# EAGLE design SX-150 Mk II (EAGLE 7.4.0)
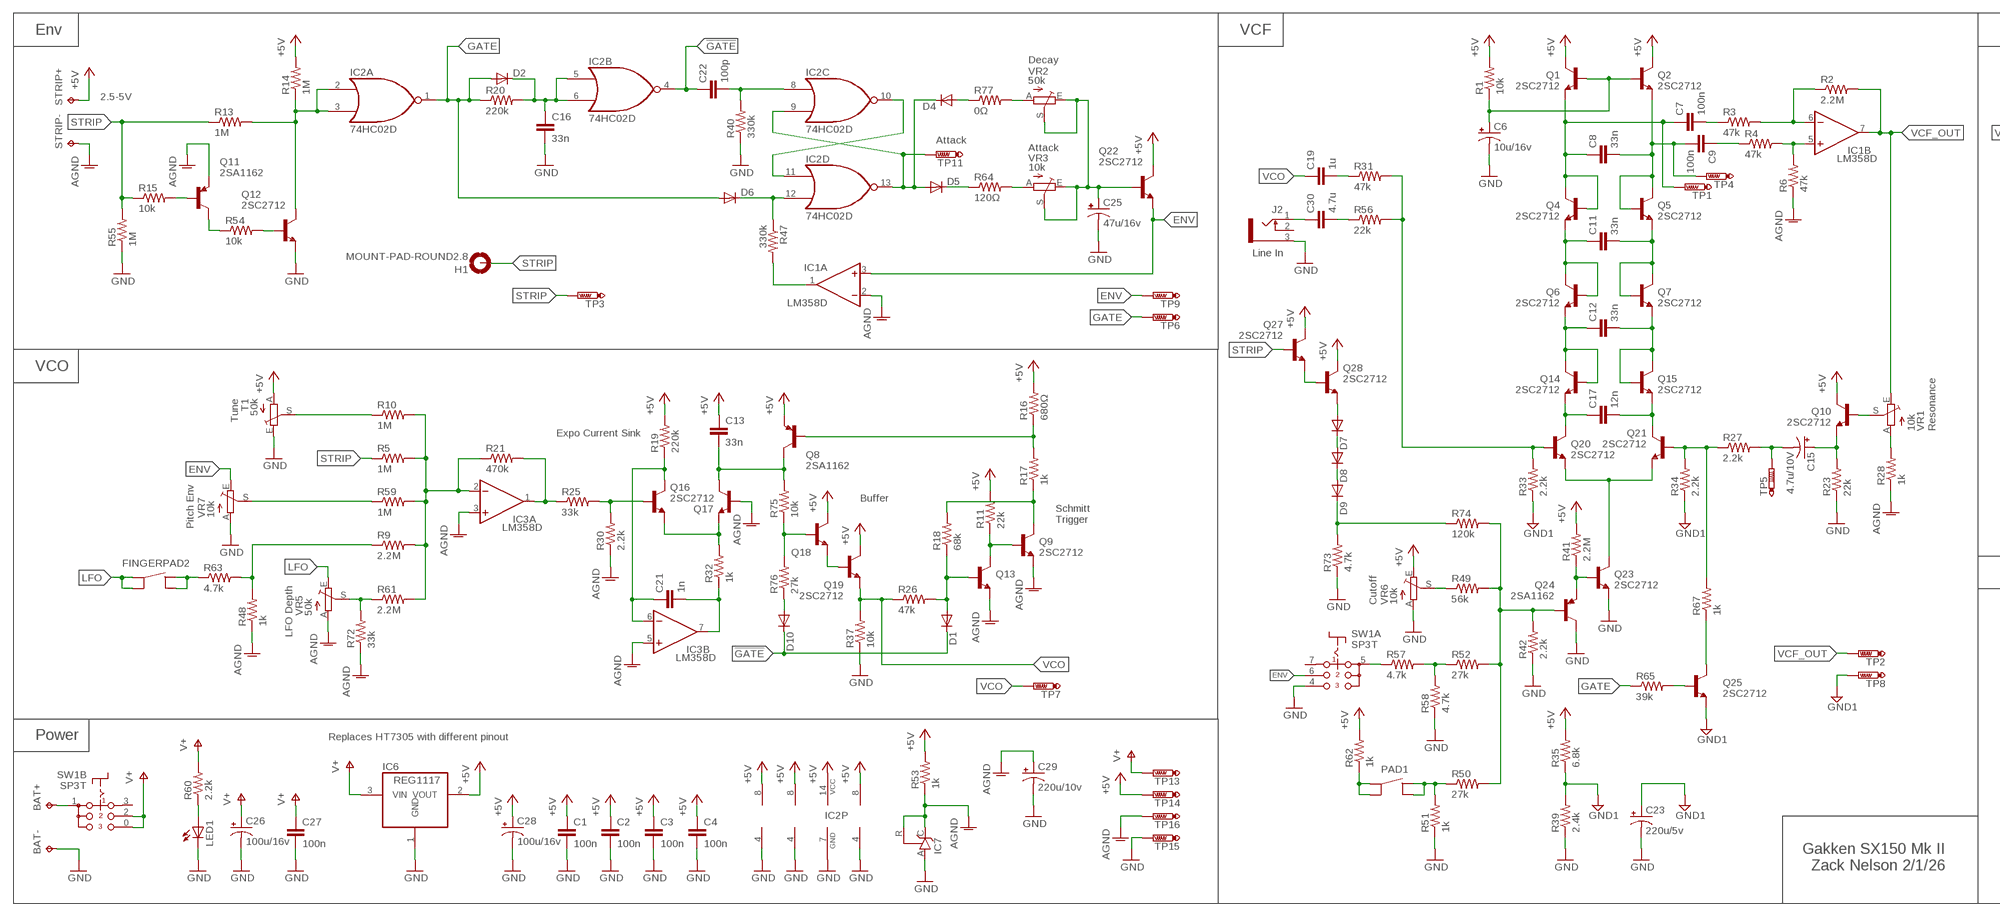
[diagram p0: schematic, sheet 1, part 1 of 2]
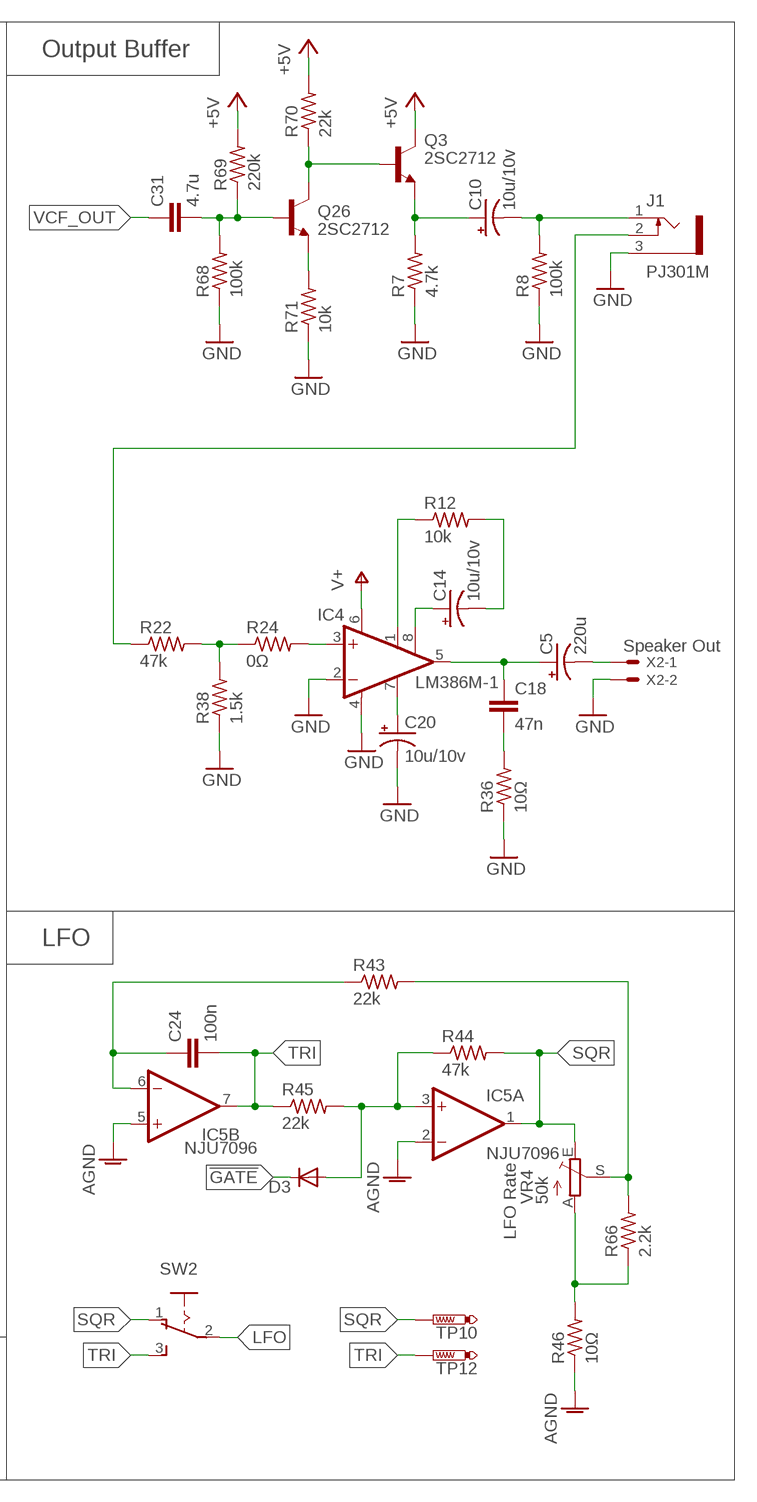
[diagram p1: schematic, sheet 1, part 2 of 2]

## Parts
BAT+  TPPAD1-13  [P1-13]
BAT-  TPPAD1-13  [P1-13]
C1  100n  C-EUC0603  [C0603]
C2  100n  C-EUC0603  [C0603]
C3  100n  C-EUC0603  [C0603]
C4  100n  C-EUC0603  [C0603]
C5  220u  CPOL-USE2.5-6  [E2,5-6]
C6  10u/16v  CPOL-USE2.5-6  [E2,5-6]
C7  100n  C-EUC0603  [C0603]
C8  33n  C-EUC0603  [C0603]
C9  100n  C-EUC0603  [C0603]
C10  10u/10v  CPOL-USE2.5-6  [E2,5-6]
C11  33n  C-EUC0603  [C0603]
C12  33n  C-EUC0603  [C0603]
C13  33n  C-EUC0603  [C0603]
C14  10u/10v  CPOL-USE2.5-6  [E2,5-6]
C15  4.7u/10V  CPOL-USE2.5-6  [E2,5-6]
C16  33n  C-EUC0603  [C0603]
C17  12n  C-EUC0603  [C0603]
C18  47n  C-EUC0603  [C0603]
C19  1u  C-EUC0603  [C0603]
C20  10u/10v  CPOL-USE2.5-6  [E2,5-6]
C21  1n  C-EUC0603  [C0603]
C22  100p  C-EUC0603  [C0603]
C23  220u/5v  CPOL-USE2.5-6  [E2,5-6]
C24  100n  C-EUC0603  [C0603]
C25  47u/16v  CPOL-USE2.5-6  [E2,5-6]
C26  100u/16v  CPOL-USE2.5-6  [E2,5-6]
C27  100n  C-EUC0603  [C0603]
C28  100u/16v  CPOL-USE2.5-6  [E2,5-6]
C29  220u/10v  CPOL-USE2.5-6  [E2,5-6]
C30  4.7u  C-EUC0603  [C0603]
C31  4.7u  C-EUC0603  [C0603]
D1  DIODE-DO41-7.6  [DO41-7.6]
D2  DIODE-MINIMELF  [MINIMELF]
D3  DIODE-MINIMELF  [MINIMELF]
D4  DIODE-MINIMELF  [MINIMELF]
D5  DIODE-MINIMELF  [MINIMELF]
D6  DIODE-MINIMELF  [MINIMELF]
D7  DIODE-MINIMELF  [MINIMELF]
D8  DIODE-MINIMELF  [MINIMELF]
D9  DIODE-MINIMELF  [MINIMELF]
D10  DIODE-DO41-7.6  [DO41-7.6]
FINGERPAD2  GAKKEN-PAD  [GAKKEN-PAD]
H1  MOUNT-PAD-ROUND2.8  [2,8-PAD]
IC1  LM358D  [SO08]
IC2  74HC02D  7402D  [SO14]
IC3  LM358D  [SO08]
IC4  LM386M-1  [SO08]
IC5  NJU7096  LM358D  [SO08]
IC6  REG1117  [SOT223]
IC7  TL431CLP  [TO92-CLP]
J1  PJ301M  WQP_PJ301M-12_JACK  [JACK-3.5-NOHOLE]
J2  Line In  WQP_PJ301M-12_JACK  [JACK-3.5-NOHOLE]
LED1  LED3MM  [LED3MM]
PAD1  GAKKEN-PAD  [GAKKEN-PAD]
Q1  2SC2712  BC808-NPN-SOT23-BEC  [SOT23-BEC]
Q2  2SC2712  BC808-NPN-SOT23-BEC  [SOT23-BEC]
Q3  2SC2712  BC808-NPN-SOT23-BEC  [SOT23-BEC]
Q4  2SC2712  BC808-NPN-SOT23-BEC  [SOT23-BEC]
Q5  2SC2712  BC808-NPN-SOT23-BEC  [SOT23-BEC]
Q6  2SC2712  BC808-NPN-SOT23-BEC  [SOT23-BEC]
Q7  2SC2712  BC808-NPN-SOT23-BEC  [SOT23-BEC]
Q8  2SA1162  BC807-16-PNP-SOT23-BEC  [SOT23-BEC]
Q9  2SC2712  BC808-NPN-SOT23-BEC  [SOT23-BEC]
Q10  2SC2712  BC808-NPN-SOT23-BEC  [SOT23-BEC]
Q11  2SA1162  BC807-16-PNP-SOT23-BEC  [SOT23-BEC]
Q12  2SC2712  BC808-NPN-SOT23-BEC  [SOT23-BEC]
Q13  2SC2712  BC808-NPN-SOT23-BEC  [SOT23-BEC]
Q14  2SC2712  BC808-NPN-SOT23-BEC  [SOT23-BEC]
Q15  2SC2712  BC808-NPN-SOT23-BEC  [SOT23-BEC]
Q16  2SC2712  BC808-NPN-SOT23-BEC  [SOT23-BEC]
Q17  2SC2712  BC808-NPN-SOT23-BEC  [SOT23-BEC]
Q18  2SC2712  BC808-NPN-SOT23-BEC  [SOT23-BEC]
Q19  2SC2712  BC808-NPN-SOT23-BEC  [SOT23-BEC]
Q20  2SC2712  BC808-NPN-SOT23-BEC  [SOT23-BEC]
Q21  2SC2712  BC808-NPN-SOT23-BEC  [SOT23-BEC]
Q22  2SC2712  BC808-NPN-SOT23-BEC  [SOT23-BEC]
Q23  2SC2712  BC808-NPN-SOT23-BEC  [SOT23-BEC]
Q24  2SA1162  BC807-16-PNP-SOT23-BEC  [SOT23-BEC]
Q25  2SC2712  BC808-NPN-SOT23-BEC  [SOT23-BEC]
Q26  2SC2712  BC808-NPN-SOT23-BEC  [SOT23-BEC]
Q27  2SC2712  BC808-NPN-SOT23-BEC  [SOT23-BEC]
Q28  2SC2712  BC808-NPN-SOT23-BEC  [SOT23-BEC]
R1  10k  R-US_R0603  [R0603]
R2  2.2M  R-US_R0603  [R0603]
R3  47k  R-US_R0603  [R0603]
R4  47k  R-US_R0603  [R0603]
R5  1M  R-US_R0603  [R0603]
R6  47k  R-US_R0603  [R0603]
R7  4.7k  R-US_R0603  [R0603]
R8  100k  R-US_R0603  [R0603]
R9  2.2M  R-US_R0603  [R0603]
R10  1M  R-US_R0603  [R0603]
R11  22k  R-US_R0603  [R0603]
R12  10k  R-US_R0603  [R0603]
R13  1M  R-US_R0603  [R0603]
R14  1M  R-US_R0603  [R0603]
R15  10k  R-US_R0603  [R0603]
R16  680Ω  R-US_R0603  [R0603]
R17  1k  R-US_R0603  [R0603]
R18  68k  R-US_R0603  [R0603]
R19  220k  R-US_R0603  [R0603]
R20  220k  R-US_R0603  [R0603]
R21  470k  R-US_R0603  [R0603]
R22  47k  R-US_R0603  [R0603]
R23  22k  R-US_R0603  [R0603]
R24  0Ω  R-US_R0603  [R0603]
R25  33k  R-US_R0603  [R0603]
R26  47k  R-US_R0603  [R0603]
R27  2.2k  R-US_R0603  [R0603]
R28  1k  R-US_R0603  [R0603]
R30  2.2k  R-US_R0603  [R0603]
R31  47k  R-US_R0603  [R0603]
R32  1k  R-US_R0603  [R0603]
R33  2.2k  R-US_R0603  [R0603]
R34  2.2k  R-US_R0603  [R0603]
R35  6.8k  R-US_R0603  [R0603]
R36  10Ω  R-US_R0603  [R0603]
R37  10k  R-US_R0603  [R0603]
R38  1.5k  R-US_R0603  [R0603]
R39  2.4k  R-US_R0603  [R0603]
R40  330k  R-US_R0603  [R0603]
R41  2.2M  R-US_R0603  [R0603]
R42  2.2k  R-US_R0603  [R0603]
R43  22k  R-US_R0603  [R0603]
R44  47k  R-US_R0603  [R0603]
R45  22k  R-US_R0603  [R0603]
R46  10Ω  R-US_R0603  [R0603]
R47  330k  R-US_R0603  [R0603]
R48  1k  R-US_R0603  [R0603]
R49  56k  R-US_R0603  [R0603]
R50  27k  R-US_R0603  [R0603]
R51  1k  R-US_R0603  [R0603]
R52  27k  R-US_R0603  [R0603]
R53  1k  R-US_R0603  [R0603]
R54  10k  R-US_R0603  [R0603]
R55  1M  R-US_R0603  [R0603]
R56  22k  R-US_R0603  [R0603]
R57  4.7k  R-US_R0603  [R0603]
R58  4.7k  R-US_R0603  [R0603]
R59  1M  R-US_R0603  [R0603]
R60  2.2k  R-US_R0603  [R0603]
R61  2.2M  R-US_R0603  [R0603]
R62  1k  R-US_R0603  [R0603]
R63  4.7k  R-US_R0603  [R0603]
R64  120Ω  R-US_R0603  [R0603]
R65  39k  R-US_R0603  [R0603]
R66  2.2k  R-US_R0603  [R0603]
R67  1k  R-US_R0603  [R0603]
R68  100k  R-US_R0603  [R0603]
R69  220k  R-US_R0603  [R0603]
R70  22k  R-US_R0603  [R0603]
R71  10k  R-US_R0603  [R0603]
R72  33k  R-US_R0603  [R0603]
R73  4.7k  R-US_R0603  [R0603]
R74  120k  R-US_R0603  [R0603]
R75  10k  R-US_R0603  [R0603]
R76  27k  R-US_R0603  [R0603]
R77  0Ω  R-US_R0603  [R0603]
STRIP+  TPB1,27  [B1,27]
STRIP-  TPB1,27  [B1,27]
SW1  SP3T  [SP3T]
SW2  M251  [M251]
T1  50k  TRIM_EU-CA9V  [CA9V]
TP1  PTR1B1,27  [B1,27]
TP2  PTR1B1,27  [B1,27]
TP3  PTR1B1,27  [B1,27]
TP4  PTR1B1,27  [B1,27]
TP5  PTR1B1,27  [B1,27]
TP6  PTR1B1,27  [B1,27]
TP7  PTR1B1,27  [B1,27]
TP8  PTR1B1,27  [B1,27]
TP9  PTR1B1,27  [B1,27]
TP10  PTR1B1,27  [B1,27]
TP11  PTR1B1,27  [B1,27]
TP12  PTR1B1,27  [B1,27]
TP13  PTR1B1,27  [B1,27]
TP14  PTR1B1,27  [B1,27]
TP15  PTR1B1,27  [B1,27]
TP16  PTR1B1,27  [B1,27]
VR1  10k  TRIM_EU-CA9V  [CA9V]
VR2  50k  TRIM_EU-CA9V  [CA9V]
VR3  10k  TRIM_EU-CA9V  [CA9V]
VR4  50k  TRIM_EU-CA9V  [CA9V]
VR5  50k  TRIM_EU-CA9V  [CA9V]
VR6  10k  TRIM_EU-CA9V  [CA9V]
VR7  10k  TRIM_EU-CA9V  [CA9V]
X2  Speaker Out  22-23-2021  [22-23-2021]

## Nets
!GATE: C22.1 D1.C D3.C D10.C IC2.4(B:O)
+5V: C1.1 C2.1 C3.1 C4.1 C13.1 C28.+ IC1.8(P:V+) IC2.14(P:VCC) IC3.8(P:V+) IC5.8(P:V+) IC6.2(VOUT) Q1.C Q2.C Q3.C Q8.E Q10.C Q18.C Q19.C Q22.C Q27.C Q28.C R1.2 R11.2 R14.2 R16.2 R19.2 R35.2 R41.2 R53.2 R62.2 R69.2 R70.2 STRIP+.TP T1.A TP14.TP VR6.E
AGND: C29.+ IC1.2(A:-IN) IC3.3(A:+IN) IC3.5(B:+IN) IC5.2(A:-IN) IC5.5(B:+IN) IC7.C IC7.R Q9.E Q11.E Q13.E Q17.B R6.1 R28.1 R30.1 R46.1 R48.1 R53.1 R72.1 STRIP-.TP TP16.TP VR5.A
ENV: IC1.3(A:+IN) Q22.E SW1.6(A:T2) TP9.TP VR7.E
GATE: D2.A D6.A IC2.1(A:O) R20.1 R65.1 TP6.TP
GND: BAT-.TP C1.2 C2.2 C3.2 C4.2 C6.- C16.2 C20.- C23.- C25.- C26.- C27.2 C28.- C29.- IC1.4(P:V-) IC2.7(P:GND) IC3.4(P:V-) IC4.2(-IN) IC4.4(GND) IC5.4(P:V-) IC6.1(GND) IC7.A J1.3 J2.3 LED1.K(C) Q12.E Q23.E Q24.C R7.1 R8.1 R23.1 R36.1 R37.1 R38.1 R39.1 R40.1 R42.1 R51.1 R55.1 R58.1 R68.1 R71.1 R73.1 SW1.4(A:T3) T1.E TP15.TP VR6.A VR7.A X2.2
GND1: C23.+ Q25.E R33.1 R34.1 R35.1 R39.2 TP8.TP
LFO: FINGERPAD2.A0 FINGERPAD2.A1 SW2.2(P) VR5.E
N$1: IC1.1(A:OUT) R47.2
N$2: D5.C R64.1
N$3: IC2.2(A:I0) IC2.3(A:I1) Q12.C R13.2 R14.1
N$4: IC2.10(C:O) IC2.11(D:I0)
N$5: D4.C D5.A IC2.9(C:I1) IC2.13(D:O) TP11.TP
N$6: C22.2 IC2.8(C:I0) R40.2
N$7: Q12.B R54.2
N$8: C16.1 D2.C IC2.5(B:I0) IC2.6(B:I1) R20.2
N$9: D6.C IC2.12(D:I1) R47.1
N$10: D4.A R77.1
N$11: R77.2 VR2.A
N$12: R64.2 VR3.A
N$13: C25.+ Q22.B VR2.E VR2.S VR3.E VR3.S
N$14: Q11.C R54.1
N$15: Q11.B R15.2
N$16: R61.1 R72.2 VR5.S
N$17: C24.1 IC5.6(B:-IN) R43.1
N$18: IC3.2(A:-IN) R5.2 R9.2 R10.2 R21.1 R59.2 R61.2
N$19: D3.A IC5.3(A:+IN) R44.1 R45.2
N$20: R46.2 R66.1 VR4.A
N$21: R43.2 R66.2 VR4.S
N$22: IC3.1(A:OUT) R21.2 R25.1
N$23: Q16.B R25.2 R30.2
N$24: R59.1 VR7.S
N$25: R9.1 R48.2 R63.2
N$26: R10.1 T1.S
N$27: C13.2 Q8.C Q17.C R75.2
N$28: Q8.B R16.1 R17.2
N$29: C21.2 IC3.7(B:OUT) R32.1
N$30: Q16.E Q17.E R32.2
N$31: C21.1 IC3.6(B:-IN) Q16.C R19.1
N$32: Q9.C R17.1 R18.2
N$33: Q18.B R75.1 R76.2
N$34: Q18.E Q19.B
N$35: BAT+.TP SW1.1(B:P1)
N$36: Q9.B Q13.C R11.1
N$37: D1.A Q13.B R18.1 R26.2
N$38: D10.A R76.1
N$39: C7.1 C8.1 Q1.E Q4.B Q4.C TP1.TP
N$40: C8.2 C9.2 Q2.E Q5.B Q5.C TP4.TP
N$41: C6.+ Q1.B Q2.B R1.1
N$42: Q20.E Q21.E Q23.C
N$43: C11.1 Q4.E Q6.B Q6.C
N$44: C11.2 Q5.E Q7.B Q7.C
N$45: Q20.B R31.2 R33.2 R56.2
N$46: C12.1 Q6.E Q14.B Q14.C
N$47: C12.2 Q7.E Q15.B Q15.C
N$48: C17.1 Q14.E Q20.C
N$49: C17.2 Q15.E Q21.C
N$50: Q21.B R27.1 R34.2 R67.2
N$51: C7.2 R3.1
N$52: C9.1 R4.1
N$53: IC1.6(B:-IN) R2.1 R3.2
N$54: IC1.5(B:+IN) R4.2 R6.2
N$55: Q23.B Q24.E R41.1
N$56: Q25.C R67.1
N$57: Q25.B R65.2
N$58: C15.- R27.2 TP5.TP
N$59: C15.+ Q10.E R23.2
N$60: Q10.B VR1.S
N$61: R28.2 VR1.A
N$63: Q24.B R42.2 R49.2 R50.2 R52.2 R74.2
N$64: R57.1 SW1.5(A:P1)
N$65: R49.1 VR6.S
N$66: R52.1 R57.2 R58.2
N$67: PAD1.B0 PAD1.B1 R50.1 R51.2
N$68: C19.2 R31.1
N$69: C30.2 R56.1
N$70: C30.1 J2.1
N$71: C31.2 Q26.B R68.2 R69.1
N$72: Q3.B Q26.C R70.1
N$73: Q26.E R71.2
N$74: C10.+ Q3.E R7.2
N$75: C10.- J1.1 R8.2
N$76: Q27.E Q28.B
N$77: PAD1.A0 PAD1.A1 R62.1
N$78: D7.A Q28.E
N$79: D7.C D8.A
N$80: D8.C D9.A
N$81: D9.C R73.2 R74.1
N$82: FINGERPAD2.B0 FINGERPAD2.B1 R63.1
N$83: C20.+ IC4.7(BYPASS)
N$84: C14.+ IC4.8(GAIN)
N$85: IC4.1(GAIN) R12.1
N$86: C14.- R12.2
N$87: C5.+ C18.1 IC4.5(OUT)
N$88: IC4.3(+IN) R24.2
N$89: C5.- X2.1
N$90: J1.2 R22.1
N$91: C18.2 R36.2
N$93: R22.2 R24.1 R38.2
N$94: LED1.A R60.1
SQR: IC5.1(A:OUT) R44.2 SW2.1(O) TP10.TP VR4.E
STRIP: H1.B2,8(MOUNT) Q27.B R5.1 R13.1 R15.1 R55.2 TP3.TP
TRI: C24.2 IC5.7(B:OUT) R45.1 SW2.3(S) TP12.TP
V+: C26.+ C27.1 IC4.6(VS) IC6.3(VIN) R60.2 SW1.0(B:T3) SW1.2(B:T2) TP13.TP
VCF_OUT: C31.1 IC1.7(B:OUT) R2.2 TP2.TP VR1.E
VCO: C19.1 Q19.E R26.1 R37.2 TP7.TP
Unconnected: J2.2 SW1.3(B:T1) SW1.7(A:T1)

## Notes on the sheet
- Env | VCF | Output Buffer
- Decay
- 2.5-5V
- Attack
- Attack
- VCO
- Tune
- Resonance
- Expo Current Sink
- Buffer
- Schmitt
  Trigger
- Pitch Env
- LFO
- Cutoff
- LFO Depth
- Power | Replaces HT7305 with different pinout
- LFO Rate
- Gakken SX150 Mk II
  Zack Nelson 2/1/26

## Library data of the parts
BAT+ BAT- STRIP+ STRIP- = testpad:TP: Test pad
C1-C4 C7-C9 C11-C13 C16-C19 C21 C22 C24 C27 C30 C31 = rcl:C-EU: CAPACITOR, European symbol; SPICEPREFIX: C
C5 C6 C10 C14 C15 C20 C23 C25 C26 C28 C29 = rcl:CPOL-US: POLARIZED CAPACITOR, American symbol; SPICEPREFIX: C
D1-D10 = diode:DIODE-: DIODE
FINGERPAD2 PAD1 = dom-key:GAKKEN-PAD
H1 = holes:MOUNT-PAD-ROUND: MOUNTING PAD, round
IC1 IC3 IC5 = linear:LM358: OP AMP also LM158; LM258; LM2904 Source: http://cache.national.com/ds/LM/LM158.pdf
IC2 = 74xx-us:74*02: Quad 2-input NOR gate
IC4 = linear (TSSOP):LM386?-*: Low Voltage Audio Power Amplifier Source: http://cache.national.com/ds/LM/LM386.pdf
IC6 = burr-brown:REG1117: 800mA and 1A Low Dropout (LDO) Positive Regulator 1.8V, 2.5V, 2.85V, 3.3V, 5V, and Adj; MPN: REG1117; OC_FARNELL: 1097566; OC_NEWARK: 14P6981
IC7 = v-reg:TL431CLP: VOLTAGE REGULATOR
J1 J2 = thonkiconn_eagle_v5 (2):WQP_PJ301M-12_JACK: 3.5mm Vertical Jack from Thonk.co.uk
LED1 = led:LED: LED OSRAM: - CHIPLED LG R971, LG N971, LY N971, LG Q971, LY Q971, LO R971, LY R971 LH N974, LH R974 LS Q976, LO Q976, LY Q976 LO Q996 - Hyper CHIPLED LW Q18S LB Q993, LB Q99A, LB R99A - SideLED LS A670, LO A670, LY A670, LG A670, LP A670 LB A673, LV A673, LT A673, LW A673 LH A674 LY A675 LS A676, LA A676, LO A676, LY A676, LW A676 LS A679, LY A679, LG A679 - Hyper Micro SIDELED® LS Y876, LA Y876, LO Y876, LY Y876 LT Y87S - SmartLED LW L88C, LW L88S LB L89C, LB L89S, LG L890 LS L89K, LO L89K, LY L89K LS L896, LA L896, LO L896, LY L896 - TOPLED LS T670, LO T670, LY T670, LG T670, LP T670 LSG T670, LSP T670, LSY T670, LOP T670, LYG T670 LG T671, LOG T671, LSG T671 LB T673, LV T673, LT T673, LW T673 LH T674 LS T676, LA T676, LO T676, LY T676, LB T676, LH T676, LSB T676, LW T676 LB T67C, LV T67C, LT T67C, LS T67K, LO T67K, LY T67K, LW E67C LS E67B, LA E67B, LO E67B, LY E67B, LB E67C, LV E67C, LT E67C LW T67C LS T679, LY T679, LG T679 LS T770, LO T770, LY T770, LG T770, LP T770 LB T773, LV T773, LT T773, LW T773 LH T774 LS E675, LA E675, LY E675, LS T675 LS T776, LA T776, LO T776, LY T776, LB T776 LHGB T686 LT T68C, LB T68C - Hyper Mini TOPLED® LB M676 - Mini TOPLED Santana® LG M470 LS M47K, LO M47K, LY M47K Source: http://www.osram.convergy.de LUXEON: - LUMILED® LXK2-PW12-R00, LXK2-PW12-S00, LXK2-PW14-U00, LXK2-PW14-V00 LXK2-PM12-R00, LXK2-PM12-S00, LXK2-PM14-U00 LXK2-PE12-Q00, LXK2-PE12-R00, LXK2-PE12-S00, LXK2-PE14-T00, LXK2-PE14-U00 LXK2-PB12-K00, LXK2-PB12-L00, LXK2-PB12-M00, LXK2-PB14-N00, LXK2-PB14-P00, LXK2-PB14-Q00 LXK2-PR12-L00, LXK2-PR12-M00, LXK2-PR14-Q00, LXK2-PR14-R00 LXK2-PD12-Q00, LXK2-PD12-R00, LXK2-PD12-S00 LXK2-PH12-R00, LXK2-PH12-S00 LXK2-PL12-P00, LXK2-PL12-Q00, LXK2-PL12-R00 Source: www.luxeon.com KINGBRIGHT: KA-3528ASYC Source: www.kingbright.com
Q1-Q7 Q9 Q10 Q12-Q23 Q25-Q28 = transistor:*-NPN-: NPN Transistror BF959 corrected 2008.03.06
Q8 Q11 Q24 = transistor:*-PNP-: PNP Transistror
R1-R28 R30-R77 = rcl:R-US_: RESISTOR, American symbol; SPICEPREFIX: R
SW1 = switch:SP3T
SW2 = switch:M251: SLIDING SWITCH Mors, distributor Buerklin, 11G702
T1 VR1-VR7 = pot:TRIM_EU-: POTENTIOMETER
TP1-TP16 = testpad:PTR1: TEST PIN
X2 = con-molex:22-23-2021: .100" (2.54mm) Center Header - 2 Pin; MF: MOLEX; MPN: 22-23-2021; OC_FARNELL: 1462926; OC_NEWARK: 25C3832

## Board
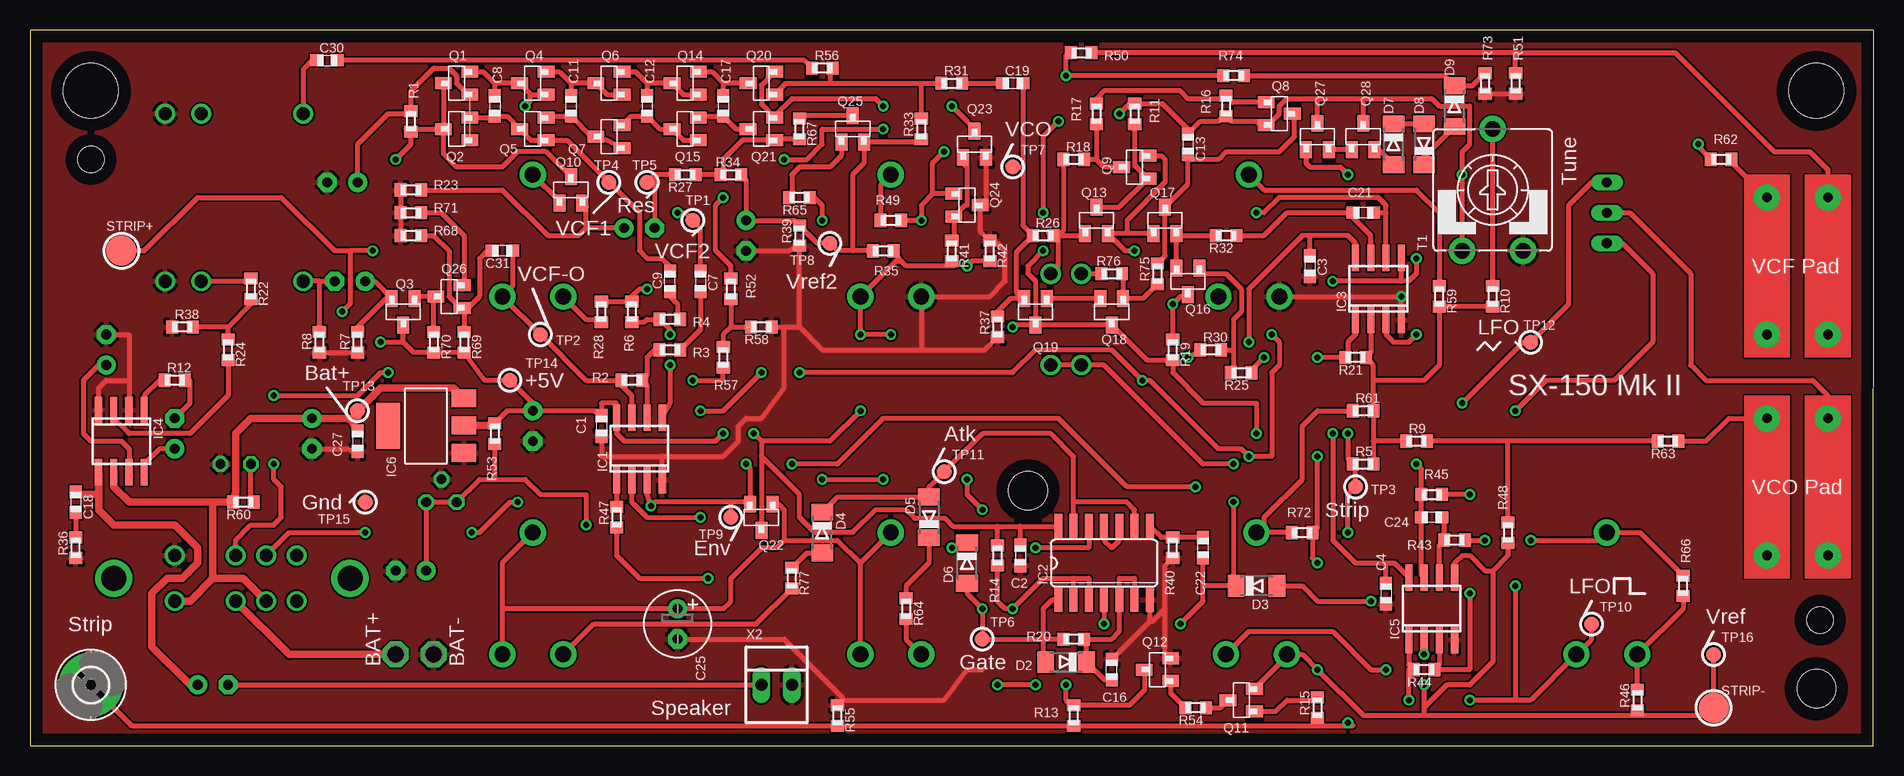
[diagram p2: board, top side]
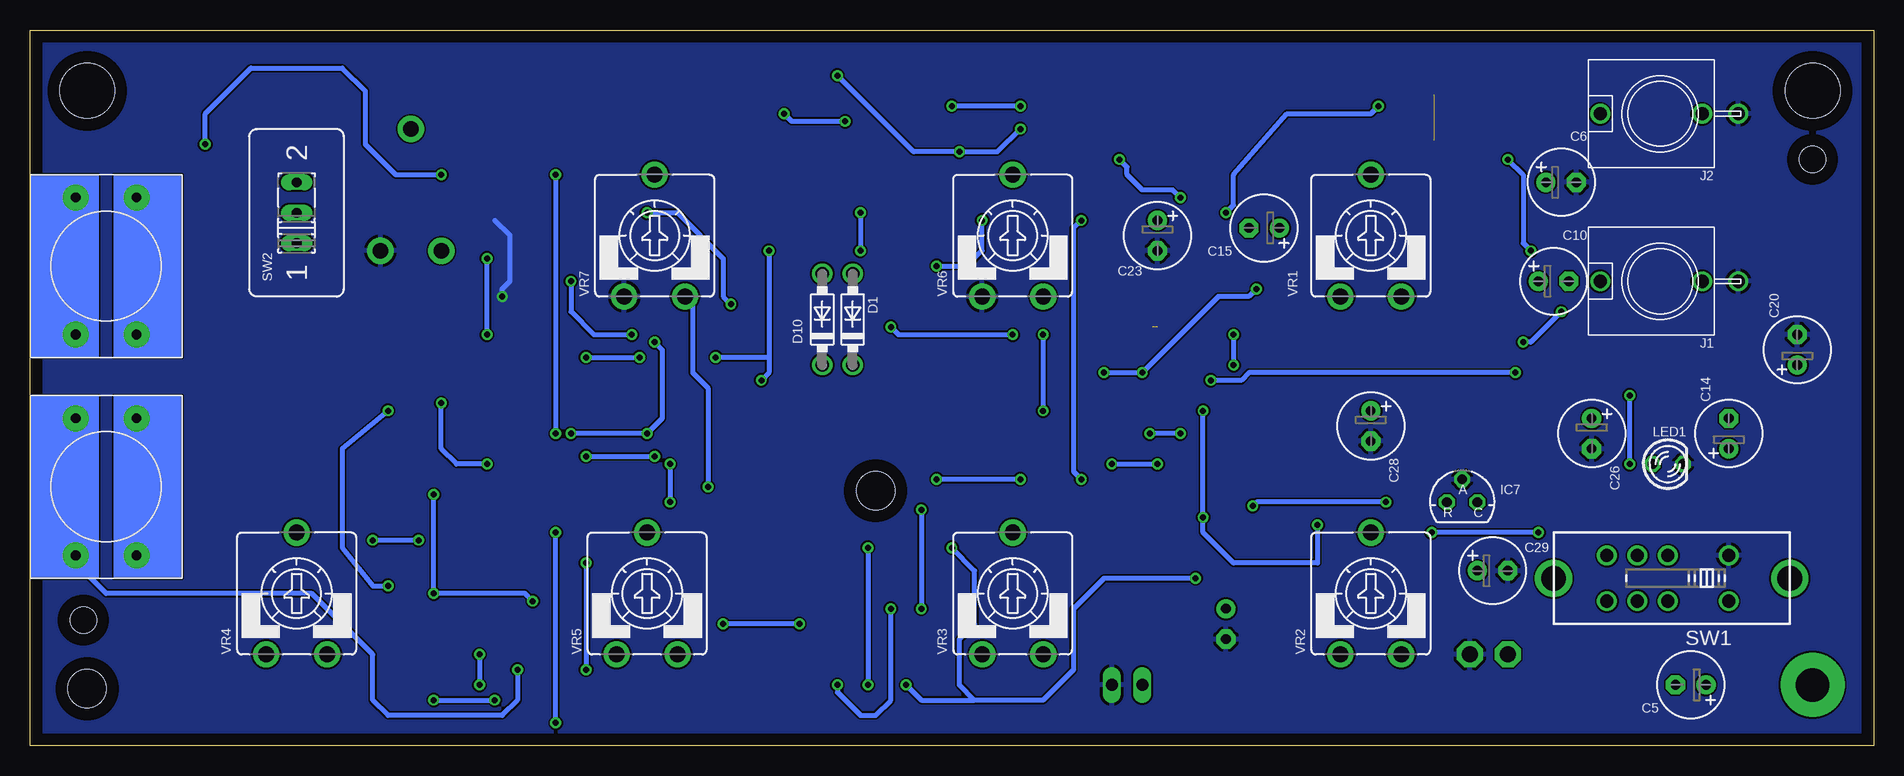
[diagram p3: board, bottom side, seen from below]

Size 153.67 x 59.69 mm. Coordinates in mm from the lower left corner, seen from the top.
Outline: 0,0 153.65,0 153.67,59.69 0,59.69 0,0
Copper layers (1*16): Top 0.035mm / dielectric 1.5mm / Bottom 0.035mm
Design rules "default": minimum track width 6mil, minimum drill 0.35mm, track to track 6mil, track to pad 6mil, pad to pad 6mil, via to via 6mil, smd to smd 6mil, copper to edge 40mil, drill to drill 6mil, minimum pad ring 10mil, minimum via ring 8mil, stop-mask expansion 4mil, vias tented up to drill 0mil, thermal gap 10mil
Holes 3.2 mm at 83.19,21.27 148.91,4.76
Holes 4.57 mm at 148.91,54.61 5.08,54.61
Holes 2.2 mm at 5.08,48.9 149.22,10.48

### Footprints (pad centres in the part's own frame; a part is rotated, then mirrored left to right if it is on the bottom)
P1-13 = drill 1.321 pad 2.159 octagon: TP 0,0
C0603 = smd 1.1 x 1: 1 -0.85,0; 2 0.85,0
E2,5-6 = drill 0.813 pad 1.6: + -1.27,0 | drill 0.813 pad 1.6 octagon: - 1.27,0
DO41-7.6 = drill 1.1 pad 1.7: A 3.81,0; C -3.81,0
MINIMELF = smd 1.4 x 1.8: A 1.7,0; C -1.7,0
GAKKEN-PAD = drill 0.8 pad 2.184: A0 -2.54,5.715; A1 -2.54,-5.715; B0 2.54,5.715; B1 2.54,-5.715
2,8-PAD = drill 2.8 pad 5.334: B2,8 0,0
SO08 = smd 0.6 x 2.2: 1 -1.905,-2.6; 2 -0.635,-2.6; 3 0.635,-2.6; 4 1.905,-2.6; 5 1.905,2.6; 6 0.635,2.6; 7 -0.635,2.6; 8 -1.905,2.6
SO14 = smd 0.66 x 2.032: 1 -3.81,-3.073; 2 -2.54,-3.073; 3 -1.27,-3.073; 4 0,-3.073; 5 1.27,-3.073; 6 2.54,-3.073; 7 3.81,-3.073; 8 3.81,3.073; 9 2.54,3.073; 10 1.27,3.073; 11 0,3.073; 12 -1.27,3.073; 13 -2.54,3.073; 14 -3.81,3.073
SOT223 = smd 1.499 x 2.007: 1 -2.261,-3.15; 2 0.025,-3.15; 3 2.311,-3.15 | smd 3.81 x 2.007: 4 0,3.15
TO92-CLP = drill 0.813 octagon: A 0,1.905; C 1.27,0; R -1.27,0
JACK-3.5-NOHOLE = drill 1.1: 1 0,5; 2 0,-3.5; 3 0,-6.5
LED3MM = drill 0.813 octagon: A -1.27,0; K 1.27,0
SOT23-BEC = smd 1 x 1.4: B -0.95,-1.1; C 0,1.1; E 0.95,-1.1
R0603 = smd 1 x 1.1: 1 -0.85,0; 2 0.85,0
B2,54 = smd 2.54 x 2.54: TP 0,0
SP3T = drill 1.1: 0 -4.445,1.905; 1 0.635,1.905; 2 3.175,1.905; 3 5.715,1.905; 4 -4.445,-1.905; 5 0.635,-1.905; 6 3.175,-1.905; 7 5.715,-1.905 | drill 2.083: P$1 -9.525,0; P$2 10.16,0
M251 = drill 0.813 long: 1 -2.54,0; 2 0,0; 3 2.54,0
CA9V = drill 1.321 pad 2.184: A -2.54,-5.08; E 2.54,-5.08; S 0,5.08
B1,27 = smd 1.27 x 1.27: TP 0,0
22-23-2021 = drill 1 long: 1 -1.27,0; 2 1.27,0

### Placement (x,y rotation side)
BAT+  30.48,7.62 90 top
BAT-  33.66,7.62 90 top
C1  47.62,26.67 270 top
C2  82.55,15.88 270 top
C3  106.68,40.01 270 top
C4  113.03,12.7 270 top
C5  15.24,5.08 180 bottom
C6  26.04,46.99 0 bottom
C7  55.88,38.73 270 top
C8  38.73,53.34 270 top
C9  53.34,38.73 90 top
C10  26.67,38.73 0 bottom
C11  45.09,53.34 270 top
C12  51.44,53.34 270 top
C13  96.52,50.16 270 top
C14  12.06,26.04 90 bottom
C15  50.8,43.18 180 bottom
C16  90.17,6.35 90 top
C17  57.78,53.34 270 top
C18  3.81,20.32 270 top
C19  81.92,55.24 180 top
C20  6.35,33.02 90 bottom
C21  111.12,44.45 180 top
C22  97.79,16.51 90 top
C23  59.69,42.55 270 bottom
C24  116.84,19.05 180 top
C25  53.98,10.16 270 top
C26  23.5,26.04 270 bottom
C27  27.3,25.4 270 top
C28  41.91,26.67 270 bottom
C29  31.75,14.61 0 bottom
C30  24.77,57.15 0 top
C31  39.37,41.27 180 top
D1  85.09,35.56 90 bottom
D2  86.36,6.99 180 top
D3  102.23,13.34 0 top
D4  66.04,17.78 270 top
D5  74.93,19.05 90 top
D6  78.11,15.24 270 top
D7  113.67,50.16 270 top
D8  116.2,50.16 90 top
D9  118.75,53.34 270 top
D10  87.63,35.56 90 bottom
FINGERPAD2  147.32,21.59 0 bottom
H1  5.08,5.08 0 top
IC1  50.8,24.77 0 top
IC2  89.53,15.24 0 top
IC3  112.39,38.1 0 top
IC4  7.62,25.4 180 top
IC5  116.84,11.43 0 top
IC6  33.02,26.67 90 top
IC7  34.29,20.32 0 bottom
J1  17.78,38.73 90 bottom
J2  17.78,52.7 90 bottom
LED1  17.14,23.5 0 bottom
PAD1  147.32,40.01 180 bottom
Q1  35.56,55.24 90 top
Q2  35.56,51.44 90 top
Q3  31.11,36.2 180 top
Q4  41.91,55.24 90 top
Q5  41.91,51.44 90 top
Q6  48.26,55.24 90 top
Q7  48.26,50.8 90 top
Q8  104.14,52.7 270 top
Q9  92.08,48.26 90 top
Q10  45.09,46.35 0 top
Q11  100.97,3.81 90 top
Q12  93.98,6.35 90 top
Q13  88.9,43.81 0 top
Q14  54.61,55.24 90 top
Q15  54.61,51.44 90 top
Q16  96.52,38.73 180 top
Q17  94.61,43.81 0 top
Q18  90.17,36.2 180 top
Q19  83.82,36.2 180 top
Q20  60.96,55.24 90 top
Q21  60.96,51.44 90 top
Q22  60.96,19.05 180 top
Q23  78.74,50.16 0 top
Q24  78.11,45.09 270 top
Q25  68.58,51.44 0 top
Q26  34.92,37.47 90 top
Q27  107.31,50.8 0 top
Q28  111.12,50.8 0 top
R1  31.75,52.07 270 top
R2  50.16,30.48 180 top
R3  53.34,33.02 180 top
R4  53.34,35.56 180 top
R5  111.12,23.5 0 top
R6  50.16,36.2 270 top
R7  27.3,33.66 90 top
R8  24.13,33.66 90 top
R9  115.57,25.4 180 top
R10  121.92,37.47 270 top
R11  92.08,52.7 90 top
R12  12.06,30.48 0 top
R13  87,2.54 90 top
R14  80.64,15.88 90 top
R15  107.31,3.17 90 top
R16  99.69,53.34 270 top
R17  88.9,52.7 90 top
R18  87,48.9 0 top
R19  95.25,33.02 270 top
R20  87,8.89 0 top
R21  110.49,32.38 180 top
R22  18.41,38.1 270 top
R23  31.75,46.35 0 top
R24  16.51,33.02 270 top
R25  100.97,31.11 180 top
R26  84.45,42.55 0 top
R27  54.61,47.62 180 top
R28  47.62,36.2 270 top
R30  98.42,33.02 0 top
R31  76.83,55.24 180 top
R32  99.69,42.55 180 top
R33  74.3,51.44 90 top
R34  58.42,47.62 180 top
R35  71.12,41.27 0 top
R36  3.81,16.51 90 top
R37  80.64,34.92 90 top
R38  12.7,34.92 0 top
R39  64.14,42.55 90 top
R40  95.25,16.51 90 top
R41  76.83,41.27 270 top
R42  80.01,41.27 270 top
R43  118.75,17.14 0 top
R44  116.2,6.35 180 top
R45  116.84,20.95 0 top
R46  133.99,3.81 90 top
R47  48.9,19.05 90 top
R48  123.19,17.78 90 top
R49  71.75,43.81 0 top
R50  87.63,57.78 180 top
R51  123.83,55.24 90 top
R52  58.42,38.1 90 top
R53  38.73,26.04 90 top
R54  97.16,3.17 180 top
R55  67.31,2.54 270 top
R56  66.04,56.52 0 top
R57  57.78,32.38 90 top
R58  60.96,34.92 180 top
R59  117.47,37.47 270 top
R60  17.78,20.32 180 top
R61  111.12,27.94 0 top
R62  140.97,48.9 180 top
R63  136.53,25.4 180 top
R64  73.03,11.43 270 top
R65  64.14,45.72 180 top
R66  137.79,13.34 90 top
R67  64.14,51.44 270 top
R68  31.75,42.55 0 top
R69  36.2,33.66 270 top
R70  33.66,33.66 270 top
R71  31.75,44.45 0 top
R72  106.05,17.78 180 top
R73  121.28,55.24 90 top
R74  100.33,55.88 180 top
R75  93.98,39.37 90 top
R76  90.17,39.37 0 top
R77  63.5,13.97 270 top
STRIP+  TPB2,54  [B2,54]  7.62,41.27 0 top
STRIP-  TPB2,54  [B2,54]  140.34,3.17 0 top
SW1  16.51,13.97 180 bottom
SW2  131.44,44.45 90 bottom
T1  121.92,46.35 0 top
TP1  55.24,43.81 180 top
TP2  42.55,34.29 0 top
TP3  110.49,21.59 0 top
TP4  48.26,46.99 0 top
TP5  51.44,46.99 0 top
TP6  79.38,8.89 90 top
TP7  81.92,48.26 0 top
TP8  66.67,41.91 0 top
TP9  58.42,19.05 180 top
TP10  130.18,10.16 0 top
TP11  76.2,22.86 0 top
TP12  125.09,33.66 0 top
TP13  27.3,27.94 0 top
TP14  40.01,30.48 0 top
TP15  27.94,20.32 180 top
TP16  140.34,7.62 0 top
VR1  41.91,42.55 0 bottom
VR2  41.91,12.7 0 bottom
VR3  71.75,12.7 0 bottom
VR4  131.44,12.7 0 bottom
VR5  102.23,12.7 0 bottom
VR6  71.75,42.55 0 bottom
VR7  101.6,42.55 0 bottom
X2  62.23,5.08 0 top

### Tracks (layer width: path | path; a pad name or v marks a point on that pad's centre or on a via)
!GATE  (via drill 0.5)
  Top 0.406: IC2.4 v89.53,10.16 | v95.89,10.16 97.79,12.06 97.79,13.34 | 97.79,13.34 C22.1 | D3.C 100.33,13.34 | 100.33,13.34 97.79,13.34 | D1.C D10.C 89.53,31.75 97.79,23.5 v100.33,23.5 | v100.33,20.32 100.33,13.34
  Bottom 0.406: v89.53,10.16 v95.89,10.16 | v100.33,23.5 v100.33,20.32
+5V  (via drill 0.5)
  Top 0.406: Q1.C Q2.C | Q2.C 31.33,51.44 R1.2 31.75,50.16 v30.48,48.9 | Q10.C 43.01,49.53 40.64,49.53 39.37,48.26 35.56,48.26 34.46,49.36 Q2.C | v28.57,41.27 26.67,41.27 | 26.67,41.27 25.4,41.27 20.95,45.72 13.97,45.72 9.53,41.27 STRIP+.TP | 26.67,41.27 26.67,36.83 v26.04,36.2 | v29.21,33.66 31.11,33.66 | 31.11,33.66 Q3.C | 31.11,33.66 31.96,32.8 R70.2 R69.2 37.88,30.48 TP14.TP 41.91,28.57 C28.+ | Q27.C 107.31,53.98 | 107.31,53.98 111.12,53.98 | 107.31,53.98 104.78,53.98 104.14,53.34 104.14,52.7 103.19,51.76 Q8.E 102.55,51.76 102.23,52.07 100.11,52.07 R16.2 99.48,52.49 99.06,52.07 97.58,52.07 C13.1 96.52,51.44 94.4,53.55 R11.2 91.66,53.55 v90.81,52.7 | R41.2 77.05,40.01 73.03,40.01 72.61,40.42 | 72.61,40.42 R35.2 | 72.61,40.42 72.17,40.42 VR6.E v69.22,34.29 v71.75,34.29 | Q19.C Q18.C 93.09,32.17 R19.2 95.25,31.11 97.79,28.57 102.23,28.57 v102.23,26.04 | 60.96,24.13 64.14,20.95 64.14,19.05 65.41,17.78 68.58,17.78 70.48,19.68 73.03,19.68 73.76,18.95 76.3,18.95 76.94,18.31 80.64,18.31 | 60.96,24.13 Q22.C | v57.78,26.04 57.15,25.4 49.53,25.4 48.9,26.04 IC1.8 48.9,28.57 47.62,28.57 C1.1 46.99,27.94 C28.+ | 60.96,25.4 60.96,24.13 | IC3.8 110.49,41.91 109.86,42.55 106.68,42.55 | 106.68,42.55 106.05,42.55 101.6,38.1 v101.6,33.66 | v108.58,26.04 108.58,17.14 110.49,15.24 113.03,15.24 | 113.03,15.24 113.72,15.24 IC5.8 | Q28.C 111.12,53.98 | 111.12,53.98 116.84,53.98 117.47,53.34 120.02,53.34 120.02,50.16 119.38,49.53 v119.38,47.62 T1.A | C4.1 113.03,15.24 | C3.1 106.68,42.55 | Q19.C 82.08,35.09 v81.92,34.92 | v69.22,27.94 66.67,25.4 60.96,25.4 | 60.96,25.4 v60.33,26.04 | C28.+ 39.79,27.94 R53.2
  Top 0.406: v85.72,52.07 84.45,50.8 v84.45,44.45 | v84.45,41.27 83.19,40.01 83.19,39.37 83.82,38.73 Q19.C | 80.64,18.31 82.55,18.31 | 82.55,18.31 IC2.14 | R14.2 80.64,18.31 | C2.1 82.55,18.31 | v139.06,50.16 139.06,49.95 R62.2
  Top 0.61: R53.2 38.29,26.7 IC6.2
  Bottom 0.406: v30.48,48.9 29.21,47.62 29.21,41.91 v28.57,41.27 | v57.78,26.04 v60.33,26.04 | v101.6,33.66 100.97,33.02 100.97,27.3 v102.23,26.04 v108.58,26.04 | v81.92,34.92 81.28,34.29 v71.75,34.29 | v69.22,34.29 v69.22,27.94 | v139.06,50.16 139.06,52.7 135.25,56.52 127.64,56.52 125.73,54.61 125.73,50.16 123.19,47.62 v119.38,47.62 | v90.81,52.7 90.17,52.07 v85.72,52.07 | v84.45,44.45 v84.45,41.27 | v26.04,36.2 28.57,33.66 v29.21,33.66
AGND  (via drill 0.5)
  Top 0.406: R28.1 R6.1 50.16,37.47 50.8,38.1 v51.44,38.1 | Q9.E 94.3,49.21 94.61,48.9 94.61,46.99 91.44,43.81 91.44,42.72 | Q17.B 91.44,42.72 | 91.44,42.72 Q13.E 91.29,41.27 v92.08,41.27 | IC3.3 113.03,34.29 113.67,33.66 114.94,33.66 v115.57,34.29 | v96.52,32.38 R30.1 | v115.57,40.64 115.57,39.37 114.94,38.73 114.3,38.73 | 114.3,38.73 IC3.5 | IC1.2 50.16,20.32 51.44,19.05 v55.88,19.05 | v55.88,27.94 57.78,27.94 v60.96,31.11 | 118.81,14.03 IC5.5 118.75,15.24 119.38,15.88 120.02,15.88 121.28,14.61 121.92,14.61 | Q11.E 104.78,7.47 VR5.A 106.05,7.62 v107.31,6.35 111.12,2.54 116.2,2.54 | 116.2,2.54 133.99,2.54 | IC5.2 v116.2,7.62 | v116.2,5.08 116.2,3.17 | 116.2,3.17 116.2,2.54 | v107.31,15.24 106.89,15.66 R72.1 107.31,18.2 v107.31,24.13 | v64.14,31.11 81.92,31.11 83.82,33.02 90.17,33.02 v92.71,30.48 93.34,30.48 99.06,24.77 100.97,24.77 v101.6,24.13 103.5,24.13 103.5,31.11 104.14,31.75 104.14,33.66 v103.5,34.29 | TP16.TP STRIP-.TP 139.7,2.54 133.99,2.54 | R46.1 133.99,2.54 | 121.92,14.61 121.92,6.99 120.02,5.08 118.11,5.08 116.2,3.17 | 114.3,38.73 v108.58,38.73 | C29.+ IC7.C IC7.R 37.47,22.23 38.73,22.23 | 38.73,22.23 41.27,22.23 42.55,20.95 46.35,20.95 v46.35,18.41 | R53.1 38.73,22.23 | R48.1 123.19,15.88 121.92,14.61
  Bottom 0.406: v115.57,34.29 v115.57,40.64 | v92.08,41.27 92.08,32.38 | 92.08,32.38 v96.52,32.38 | v51.44,38.1 52.07,37.47 54.61,37.47 v60.96,31.11 v64.14,31.11 | v55.88,27.94 v55.88,19.05 55.88,17.78 53.34,15.24 46.35,15.24 v46.35,18.41 | v116.2,7.62 v116.2,5.08 | v107.31,15.24 v107.31,6.35 | v107.31,24.13 v101.6,24.13 | v108.58,38.73 108.58,36.2 106.68,34.29 v103.5,34.29 | 92.08,32.38 92.08,31.11 v92.71,30.48
ENV  (via drill 0.5)
  Top 0.406: v97.16,21.59 91.44,21.59 85.72,27.3 71.12,27.3 67.31,23.5 v63.5,23.5 | v59.69,23.5 60.01,23.18 Q22.E 59.84,20.32 58.42,20.32 | 58.42,20.32 52.07,20.32 v51.75,20 51.44,20.95 IC1.3 | TP9.TP 58.42,20.32 | SW1.6 21.59,17.78 v27.94,17.78 | v36.83,17.78 37.47,17.78 40.01,20.32 v40.64,20.32
  Bottom 0.406: VR7.E 98.42,36.83 98.42,31.11 97.16,29.84 v97.16,21.59 | v63.5,23.5 v59.69,23.5 | v27.94,17.78 v36.83,17.78 | v40.64,20.32 51.44,20.32 v51.75,20
GATE  (via drill 0.5)
  Top 0.406: IC2.1 85.19,12.17 84.45,11.43 84.45,8.89 | 84.45,8.89 84.45,7.83 D2.A | R20.1 84.45,8.89 | D6.A 78.11,12.7 v79.38,11.43 TP6.TP 84.45,8.89 | R65.1 65.41,45.72 66.04,45.09 v66.04,43.81 | v66.04,22.23 v71.12,22.23 | v78.11,22.23 78.11,20.95 v79.38,19.68
  Bottom 0.406: v66.04,43.81 66.67,43.18 66.67,22.86 v66.04,22.23 | v71.12,22.23 v78.11,22.23 | v79.38,19.68 v79.38,11.43
GND  (via drill 0.5)
  Top 0.406: R23.1 R71.1 R68.1 | R73.1 R51.1 | 79.06,45.23 Q24.C | C23.- 63.28,41.27 R39.1 64.14,34.92 | R58.1 62.87,34.92 | 62.87,34.92 64.14,34.92 | 64.14,34.92 66.04,33.02 74.3,33.02 | 74.3,33.02 79.59,33.02 R37.1 | 74.3,33.02 VR6.A 80.01,37.47 81.28,38.73 81.28,41.27 80.64,41.91 80.22,41.91 R42.1 79.2,42.93 Q24.C | IC3.4 v114.3,37.47 VR7.A | C16.2 93.34,10.38 | 93.34,10.38 IC2.7 | Q12.E 94.61,7.76 94.61,11.43 | 94.61,11.43 94.61,15.03 R40.1 | 93.34,10.38 93.56,10.38 94.61,11.43 | C25.- 62.87,8.89 67.94,3.81 76.2,3.81 78.11,6.35 79.38,6.35 | R8.1 R7.1 | C1.2 47.62,24.13 52.7,24.13 | 52.7,24.13 57.78,24.13 59.05,25.4 59.05,26.67 59.69,27.3 60.96,27.3 62.87,29.84 62.87,34.92 | IC1.4 52.7,24.13 | C20.- 8.26,34.29 8.26,30.48 | 8.26,30.48 IC4.2 | IC4.4 5.71,29.84 6.35,30.48 8.26,30.48 | C26.- 26.45,24.77 C27.2 | Q23.E 79.69,45.57 Q24.C
  Bottom 0.406: v114.3,37.47 114.3,38.1 113.67,38.73 113.67,42.55 114.94,43.81
  pour Top: 0,0 153.67,0 153.67,59.69 0,59.69
  pour Bottom: 0,0 153.67,0 153.67,59.69 0,59.69
GND1
  Top 0.406: R34.1 59.69,47.2 C23.+ 63.72,43.81 R39.2 65.62,41.91 TP8.TP 67.31,41.27 68.58,41.27 | R33.1 74.05,50.34 Q25.E 69.53,48.58 68.58,47.62 68.58,41.27 | R35.1 68.58,41.27
LFO  (via drill 0.5)
  Top 0.406: VR5.E 101.6,9.53 108.58,9.53 111.76,6.35 v113.03,6.35 | SW2.2 133.35,44.45 138.43,39.37 138.43,31.75 139.7,30.48 148.59,30.48 149.86,29.21 FINGERPAD2.A0 FINGERPAD2.A1
  Bottom 0.406: v113.03,6.35 113.03,3.81 114.3,2.54 123.83,2.54 125.09,3.81 125.09,7.62 130.18,12.7 147.32,12.7 149.86,15.24 FINGERPAD2.A1
N$1
  Top 0.406: IC1.1 R47.2
N$2
  Top 0.406: D5.C 74.93,15.24 73.03,13.34 R64.1
N$3  (via drill 0.5)
  Top 0.406: Q12.C 92.88,4.62 91.66,3.39 R13.2 86.78,3.39 86.36,3.81 v86.36,5.08 | R14.1 80.64,12.06 81.28,11.43 v81.92,11.43 84.45,13.97 87,13.97 | 87,13.97 88.27,13.97 IC2.3 | IC2.2 87,13.97
  Bottom 0.406: v86.36,5.08 86.36,4.45 84.45,2.54 83.19,2.54 81.92,3.81 v81.92,11.43
N$4
  Top 0.406: IC2.11 89.53,17.14 90.17,16.51 90.81,17.14 IC2.10
N$5
  Top 0.406: IC2.13 87,20.32 | 87,20.32 87,24.13 85.09,26.04 79.38,26.04 TP11.TP 74.93,21.59 D5.A 67.31,20.75 D4.C | IC2.9 92.08,19.68 91.44,20.32 87,20.32
N$6
  Top 0.406: C22.2 R40.2 94.3,17.36 IC2.8
N$7
  Top 0.406: Q12.B 95.08,4.4 R54.2
N$8
  Top 0.406: C16.1 89.55,5.5 D2.C 88.06,8.68 R20.2 90.17,8.89 90.81,9.53 IC2.5 90.81,13.97 92.08,13.97 IC2.6
N$9  (via drill 0.5)
  Top 0.406: R47.1 48.9,15.88 50.8,13.97 v56.52,13.97 | v76.83,16.51 77.67,16.51 D6.C | IC2.12 88.27,16.51 v83.82,16.51 | v83.82,5.08 v80.64,5.08
  Bottom 0.406: 74.93,3.81 69.22,3.81 66.67,6.35 66.67,11.43 64.14,13.97 v56.52,13.97 | 74.93,3.81 76.2,5.08 76.2,8.89 74.93,10.16 74.93,14.61 v76.83,16.51 | v83.82,16.51 v83.82,5.08 | v80.64,5.08 79.38,3.81 74.93,3.81
N$10
  Top 0.406: R77.1 64.76,16.08 D4.A
N$11
  Top 0.406: VR2.A 46.99,10.16 60.54,10.16 R77.2
N$12
  Top 0.406: R64.2 73.03,8.89 VR3.A
N$13
  Top 0.406: VR3.E 69.22,15.24 | 69.22,15.24 VR3.S | Q22.B 62.4,20.15 62.87,19.68 62.87,17.14 | 62.87,17.14 67.31,17.14 69.22,15.24 | 62.87,17.14 62.23,16.51 60.96,16.51 58.42,13.97 58.42,12.06 57.78,11.43 C25.+ 39.37,11.43 | VR2.S 39.37,15.24 39.37,11.43 | 39.37,11.43 VR2.E
N$14
  Top 0.406: R54.1 99.23,3.17 Q11.C
N$15
  Top 0.406: Q11.B 103.83,2.86 104.78,3.81 107.1,3.81 R15.2
N$16
  Top 0.406: R72.2 102.87,17.78 | 102.87,17.78 VR5.S | R61.1 107.31,27.94 106.05,26.67 106.05,22.23 102.87,19.05 102.87,17.78
N$17
  Top 0.406: IC5.6 117.47,16.73 R43.1 117.89,18.84 C24.1
N$18
  Top 0.406: R10.2 R59.2 117.47,31.75 116.2,30.48 111.97,30.48 | 111.97,25.4 R61.2 111.97,30.48 | 111.97,25.4 R5.2 | R9.2 111.97,25.4 | IC3.2 111.76,32.8 R21.1 111.97,31.75 111.97,30.48
N$19  (via drill 0.5)
  Top 0.406: IC5.3 117.47,6.77 R44.1 120.02,6.35 v120.02,12.7 | D3.A 106.05,13.34 107.31,12.06 v111.76,12.06 | v120.02,20.95 R45.2
  Bottom 0.406: v111.76,12.06 112.39,12.7 v120.02,12.7 v120.02,20.95
N$20
  Top 0.406: R66.1 137.79,11.43 VR4.A R46.2
N$21  (via drill 0.5)
  Top 0.406: R43.2 v121.28,17.14 | v125.09,17.14 130.81,17.14 VR4.S 134.2,17.78 R66.2
  Bottom 0.406: v121.28,17.14 v125.09,17.14
N$22  (via drill 0.5)
  Top 0.406: IC3.1 110.49,34.29 109.86,33.66 109.86,32.6 R21.2 v107.31,32.38 | v102.87,32.38 101.81,31.33 R25.1
  Bottom 0.406: v107.31,32.38 v102.87,32.38
N$23
  Top 0.406: 100.33,33.02 100.33,35.56 100.97,36.2 100.97,38.1 99.69,39.37 97.94,39.37 Q16.B | 100.33,33.02 100.33,31.33 R25.2 | R30.2 100.33,33.02
N$24
  Top 0.406: VR7.S 102.87,46.35 115.57,46.35 117.47,44.45 R59.1
N$25
  Top 0.406: R63.2 123.19,25.4 | 123.19,25.4 R9.1 | R48.2 123.19,25.4
N$26
  Top 0.406: R10.1 T1.S
N$27
  Top 0.406: 96.52,48.9 96.52,46.82 Q17.C 94.61,40.85 R75.2 | Q8.C 105.41,52.53 105.41,50.8 104.14,49.53 99.69,49.53 99.06,48.9 96.52,48.9 | 96.52,48.9 C13.2
N$28
  Top 0.406: R17.2 88.9,53.98 89.53,54.61 95.89,54.61 96.52,53.98 99.48,53.98 R16.1 100.23,53.66 Q8.B
N$29
  Top 0.406: R32.1 102.87,42.55 104.78,44.45 C21.2 110.28,44.03 111.76,42.55 IC3.7
N$30
  Top 0.406: R32.2 95.73,42.55 Q17.E Q16.E
N$31  (via drill 0.5)
  Top 0.406: R19.1 v95.25,36.83 95.89,37.47 96.35,37.47 Q16.C | v102.23,44.45 102.87,44.45 104.14,45.72 112.39,45.72 113.03,45.09 113.03,44.45 | IC3.6 113.03,44.45 | C21.1 113.03,44.45
  Bottom 0.406: v102.23,44.45 99.69,44.45 95.89,40.64 95.89,37.47 v95.25,36.83
N$32
  Top 0.406: Q9.C 89.53,48.26 88.9,48.9 | 88.9,48.9 R18.2 | R17.1 88.9,48.9
N$33
  Top 0.406: R75.1 92.75,37.3 Q18.B 91.12,38.63 R76.2
N$34
  Top 0.406: Q18.E Q19.B
N$35
  Top 0.61: BAT+.TP 21.59,7.62 SW1.1
N$36
  Top 0.406: R11.1 92.08,48.41 Q9.B 90.78,44.91 Q13.C
N$37
  Top 0.406: 85.72,42.55 R26.2 84.88,42.75 | 85.72,42.55 87.78,42.55 Q13.B | D1.A 85.72,40.01 85.72,42.55 | R18.1 86.14,42.97 85.72,42.55
N$38
  Top 0.406: D10.A R76.1
N$39  (via drill 0.5)
  Top 0.406: Q1.E 37.78,56.2 38.73,55.24 | 38.73,55.24 C8.1 | 38.73,55.24 Q4.C 41.68,54.38 | 41.68,54.38 41.76,54.3 Q4.B | C7.1 55.88,43.18 TP1.TP 54.61,44.45 v53.98,44.45 | v41.27,53.34 41.68,53.74 41.68,54.38
  Bottom 0.406: v53.98,44.45 53.34,45.09 53.34,47.62 48.9,52.7 41.91,52.7 v41.27,53.34
N$40
  Top 0.406: Q2.E 38.63,52.38 C8.2 39.76,52.49 Q5.C 41.76,50.48 Q5.B 44.77,50.48 TP4.TP 50.8,44.45 50.8,41.27 51.44,40.64 52.7,40.64 53.34,40.01 C9.2
N$41  (1 unrouted)
  Top 0.406: Q1.B 36.51,54.3 35.56,55.24 35.56,55.88 34.92,56.52 33.66,56.52 31.75,54.61 R1.1 31.54,52.7 29.84,52.7 27.3,50.16 C6.+
N$42  (via drill 0.5)
  Top 0.406: v71.12,53.34 70.48,53.98 63.5,53.98 62.06,52.53 Q21.E 60.96,53.48 60.96,55.09 Q20.E | v76.83,53.34 78.11,52.07 Q23.C
  Bottom 0.406: v71.12,53.34 v76.83,53.34
N$43
  Top 0.406: Q4.E 44.13,56.2 45.09,55.24 | 45.09,55.24 C11.1 | 45.09,55.24 Q6.C 48.11,54.3 Q6.B
N$44
  Top 0.406: Q5.E 43.12,52.49 C11.2 46.77,50.8 Q7.C 48.11,50.48 Q7.B
N$45
  Top 0.406: Q20.B 63.01,55.24 66.67,55.24 | 66.67,55.24 74.3,55.24 | 74.3,55.24 R31.2 | R33.2 74.3,55.24 | R56.2 66.67,56.3 66.67,55.24
N$46
  Top 0.406: Q6.E 50.48,56.2 51.44,55.24 | 51.44,55.24 C12.1 | 51.44,55.24 Q14.C 54.46,54.3 Q14.B
N$47
  Top 0.406: Q7.E 50.1,52.49 C12.2 52.49,51.44 Q15.C 54.46,50.48 Q15.B
N$48
  Top 0.406: Q14.E 56.84,56.2 57.78,55.24 | 57.78,55.24 C17.1 | Q20.C 57.78,55.24
N$49
  Top 0.406: Q15.E 55.81,52.49 C17.2 58.84,51.44 Q21.C
N$50
  Top 0.406: R67.2 62.16,50.59 Q21.B 59.38,50.48 57.78,48.9 57.78,47.84 R34.2 R27.1
N$51
  Top 0.406: C7.2 55.88,34.71 R3.1
N$52
  Top 0.406: C9.1 53.34,37.47 53.98,36.83 53.98,35.77 R4.1
N$53
  Top 0.406: R3.2 52.07,33.02 51.44,32.38 51.44,30.9 R2.1 51.44,30.06 IC1.6
N$54  (via drill 0.5)
  Top 0.406: 52.27,35.34 R4.2 | R4.2 52.7,35.56 | v53.34,31.75 53.34,28.57 IC1.5 | v53.34,34.29 53.34,34.71 R4.2 | R6.2 51.22,35.34 51.44,35.56 R4.2
  Bottom 0.406: v53.34,34.29 v53.34,31.75
N$55
  Top 0.406: Q23.B 77.79,48.58 78.11,48.26 78.11,45.09 77.95,45.09 Q24.E 77,42.3 R41.1
N$56
  Top 0.406: Q25.C 64.39,52.53 R67.1
N$57
  Top 0.406: Q25.B 67.63,49.22 66.67,48.26 64.14,48.26 63.5,47.62 63.5,45.94 R65.2
N$58
  Top 0.406: R27.2 52.07,47.62 | 52.07,47.62 C15.- | TP5.TP 52.07,47.62
N$59
  Top 0.406: C15.+ 46.35,43.18 | 46.35,43.18 46.35,44.94 Q10.E | R23.2 39.37,46.35 43.18,42.55 45.72,42.55 46.35,43.18
N$60
  Top 0.406: Q10.B 44.13,45.4 VR1.S
N$61
  Top 0.406: VR1.A 46.35,35.56 47.41,35.56 R28.2
N$63  (via drill 0.5)
  Top 0.406: R74.2 v86.36,55.88 86.36,57.57 R50.2 | Q24.B 75.25,46.03 | 75.25,46.03 74.3,45.09 v74.3,43.81 R49.2 | R42.2 78.53,40.42 v78.11,40.01 | R52.2 58.42,40.01 57.15,41.27 57.15,45.09 v57.78,45.72 | v62.87,48.9 64.77,48.9 66.04,50.16 66.04,51.44 v71.12,51.44 | 75.25,46.03 75.25,48.58 v76.2,49.53
  Bottom 0.406: v78.11,40.01 75.56,40.01 74.3,41.27 v74.3,43.81 | v57.78,45.72 58.42,46.35 60.96,46.35 62.23,47.62 62.23,48.26 v62.87,48.9 | v71.12,51.44 73.03,49.53 v76.2,49.53 80.01,49.53 v86.36,55.88
N$64  (via drill 0.5)
  Top 0.406: SW1.5 17.14,17.14 18.41,18.41 20.32,18.41 20.95,19.05 20.95,21.59 20.32,22.23 v20.32,23.5 | v20.32,29.21 27.3,29.21 29.21,31.11 v29.84,31.11 | v55.24,30.48 57.78,30.48 R57.1
  Bottom 0.406: v20.32,23.5 v20.32,29.21 | v29.84,31.11 52.07,31.11 52.7,30.48 v55.24,30.48
N$65
  Top 0.406: VR6.S 70.91,46.77 R49.1
N$66  (1 unrouted)
  Top 0.406: R52.1 58.42,34.92 | 58.42,34.92 59.69,34.92 | 58.42,34.92 57.78,34.29 R57.2
N$67
  Top 0.406: 123.83,57.78 R50.1 | R51.2 123.83,57.78 | 123.83,57.78 137.16,57.78 145.41,49.53 148.37,49.53 149.86,48.04 PAD1.B1 PAD1.B0
N$68
  Top 0.406: R31.1 C19.2
N$69
  Top 0.406: R56.1 64.56,57.15 C30.2
N$70
  Top 0.406: C30.1 23.5,57.15 22.78,56.44 J2.1
N$71
  Top 0.406: C31.2 38.1,41.27 37.47,40.64 37.47,37.47 36.52,36.52 Q26.B | R68.2 33.66,42.55 34.92,41.27 34.92,37.47 35.88,36.52 Q26.B | Q26.B 36.2,36.34 R69.1
N$72
  Top 0.406: R70.1 33.66,37.3 Q26.C 32.23,37.47 Q3.B
N$73
  Top 0.406: R71.2 34.29,44.45 36.2,42.55 36.2,38.59 Q26.E
N$74
  Top 0.406: Q3.E 30.02,37.3 | Q3.E 30,37.47 29.84,37.47 27.3,34.92 R7.2 | C10.+ 28.73,38.73 Q3.E
N$75
  Top 0.406: R8.2 24.13,38.73 | 24.13,38.73 C10.- | 24.13,38.73 J1.1
N$76
  Top 0.406: Q28.B Q27.E
N$77
  Top 0.406: PAD1.A0 PAD1.A1 141.82,48.68 R62.1
N$78
  Top 0.406: Q28.E 112.43,49.7 D7.A
N$79
  Top 0.406: D7.C D8.A
N$80
  Top 0.406: D8.C 116.2,49.1 D9.A
N$81
  Top 0.406: R74.1 117.91,55.88 D9.C 120.23,55.04 R73.2
N$82
  Top 0.406: R63.1 139.7,25.4 141.6,27.3 FINGERPAD2.B0 FINGERPAD2.B1
N$83
  Top 0.406: IC4.7 8.26,24.77 7.62,25.4 5.08,25.4 4.45,26.04 4.45,30.48 5.71,31.75 C20.+
N$84
  Top 0.406: C14.+ 10.79,24.77 9.53,23.5 IC4.8
N$85
  Top 0.406: R12.1 10.79,30.48 9.53,29.21 IC4.1
N$86
  Top 0.406: C14.- 13.34,28.57 13.34,30.48 R12.2
N$87
  Top 0.406: 4.03,20.95 C18.1
  Top 0.61: 5.71,20.95 5.71,19.68 6.99,18.41 12.06,18.41 13.97,16.51 13.97,15.24 12.7,13.97 11.43,13.97 10.16,12.7 10.16,8.26 13.34,5.08 C5.+ | IC4.5 5.71,20.95 | 5.71,20.95 4.03,20.95
N$88
  Top 0.406: R24.2 16.51,29.21 13.34,26.04 8.26,26.04 6.99,27.3 IC4.3
N$89
  Top 0.406: C5.- X2.1
N$90
  Top 0.406: J1.2 18.2,38.73 R22.1
N$91
  Top 0.406: C18.2 R36.2
N$93
  Top 0.406: 16.51,34.92 R38.2 | R24.1 16.51,34.92 | R22.2 18.41,36.83 16.51,34.92
N$94
  Top 0.406: R60.1 18.41,20.54 LED1.A
SQR  (via drill 0.5)
  Top 0.406: IC5.1 114.94,6.77 R44.2 114.94,6.35 v114.94,3.81 | 123.83,3.81 125.09,3.81 VR4.E 130.18,8.89 TP10.TP | 123.83,3.81 v120.02,3.81 | v123.83,27.94 126.36,30.48 132.08,30.48 135.25,33.66 135.25,39.37 132.72,41.91 SW2.1 | v123.83,13.34 123.83,3.81
  Bottom 0.406: v120.02,3.81 v114.94,3.81 | v123.83,27.94 127.64,24.77 127.64,16.51 125.09,13.34 v123.83,13.34
STRIP  (via drill 0.5)
  Top 0.406: Q27.B 106.36,48.58 106.68,48.26 109.22,48.26 v109.86,47.62 | v109.86,26.04 109.86,23.91 R5.1 110.49,23.28 TP3.TP 109.86,20.95 v109.86,17.78 | H1.B2,8 8.47,1.69 R55.2 R13.1 107.31,1.69 | 107.31,1.69 110.28,1.69 v109.86,1.91 | R15.1 107.31,1.69
  Bottom 0.406: v109.86,47.62 v109.86,26.04 | v109.86,1.91 v109.86,17.78
TRI  (via drill 0.5)
  Top 0.406: IC5.7 115.99,14.24 C24.2 R45.1 115.99,23.07 v115.57,23.5 | SW2.3 130.18,46.99 128.27,45.09 128.27,36.83 TP12.TP 124.46,33.66 v119.38,28.57
  Bottom 0.406: v115.57,23.5 118.11,23.5 119.38,24.77 v119.38,28.57
V+
  Top 0.61: 26.67,27.3 C26.+ 18.41,27.3 17.14,26.04 17.14,21.17 R60.2 | 26.67,27.3 27.3,27.3 TP13.TP 29.21,29.84 35.31,29.84 IC6.3 | C27.1 26.67,27.3 | IC4.6 6.99,21.59 8.26,20.32 15.24,20.32 | 15.24,20.32 R60.2 | 17.14,20.32 R60.2 | 15.24,13.97 17.78,13.97 SW1.2 | SW1.0 13.34,12.06 15.24,13.97 | 15.24,13.97 15.24,20.32
VCF_OUT
  Top 0.406: C31.1 40.22,38.31 VR1.E TP2.TP 46.35,30.48 R2.2 49.31,30.06 50.16,29.21 IC1.7
VCO
  Top 0.406: C19.1 82.77,48.26 | 82.77,48.26 82.77,43.38 R26.1 82.23,41.17 82.23,37.78 82.55,37.47 Q19.E 81.75,37.3 80.64,36.2 R37.2 | TP7.TP 82.77,48.26

### Text on the board
tNames: VCO | Tune | Res | VCF1 | VCF2 | VCF-O | Vref2 | VCF Pad | LFO | Bat+ | +5V | SX-150 Mk II | Atk | Gnd | VCO Pad | Strip | Env | LFO | Strip | Vref | Gate | Speaker